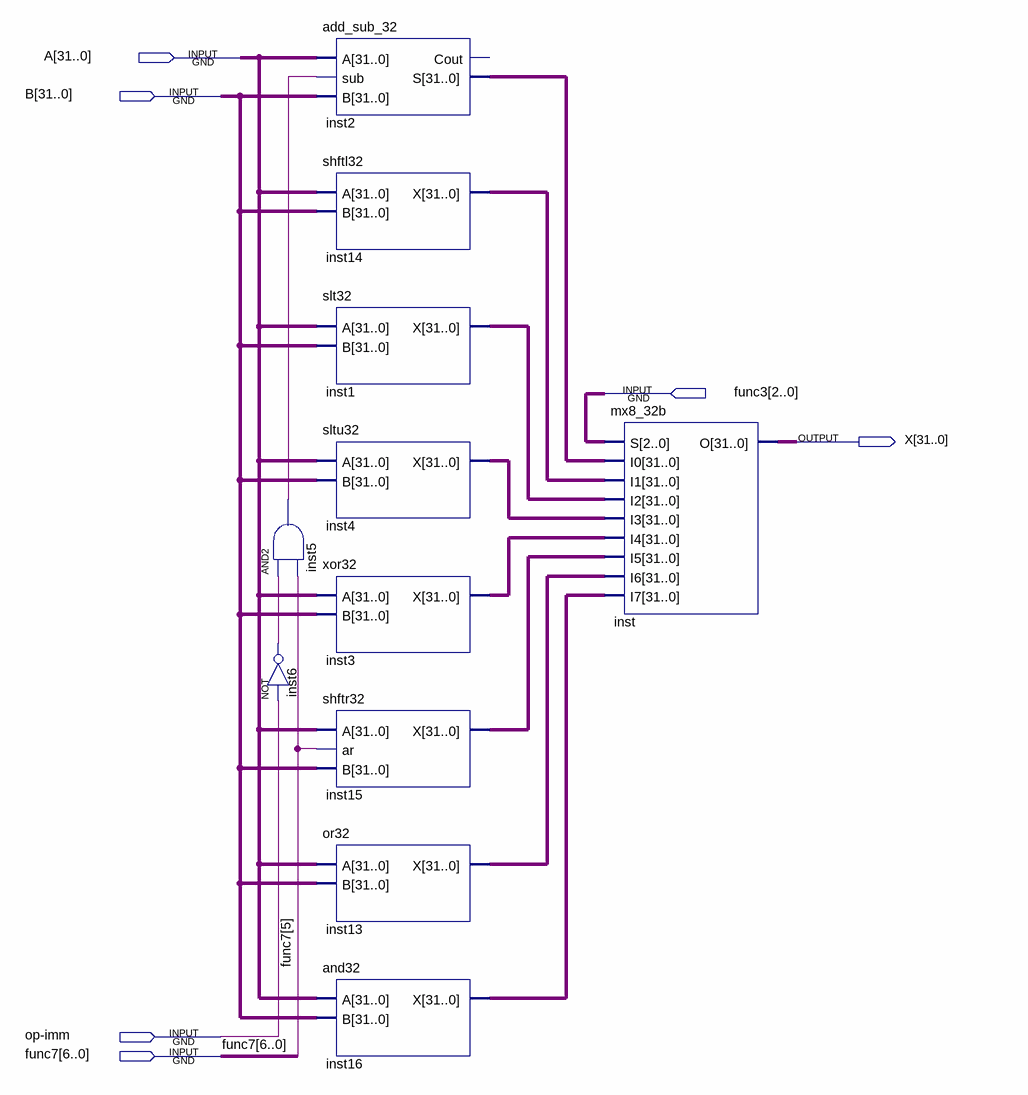
[diagram p0: schematic sheet]
// Quartus schematic alu.bdf as structural Verilog: 11 symbols, 6 pins
module alu (
  input  [31:0] A,
  input  [31:0] B,
  input  [2:0] func3,
  input  \op-imm ,
  input  [6:0] func7,
  output [31:0] X
);

  wire inst5_out, inst6_out;
  wire [31:0] inst1_x, inst2_s, inst3_x, inst4_x, inst13_x, inst14_x, inst15_x, inst16_x;

  and inst5 (inst5_out, inst6_out, func7[5]);
  not inst6 (inst6_out, \op-imm );
  add_sub_32 inst2 (.A(A), .sub(inst5_out), .B(B), .S(inst2_s));  // open: Cout
  shftl32 inst14 (.A(A), .B(B), .X(inst14_x));
  slt32 inst1 (.A(A), .B(B), .X(inst1_x));
  sltu32 inst4 (.A(A), .B(B), .X(inst4_x));
  xor32 inst3 (.A(A), .B(B), .X(inst3_x));
  shftr32 inst15 (.ar(func7[5]), .A(A), .B(B), .X(inst15_x));
  or32 inst13 (.A(A), .B(B), .X(inst13_x));
  and32 inst16 (.A(A), .B(B), .X(inst16_x));
  mx8_32b inst (
    .S(func3), .I0(inst2_s), .I1(inst14_x), .I2(inst1_x), .I3(inst4_x), .I4(inst3_x), .I5(inst15_x),
    .I6(inst13_x), .I7(inst16_x), .O(X));
endmodule
